# Altium project PhD_Energy_Harvesting_RFG.PrjPcb
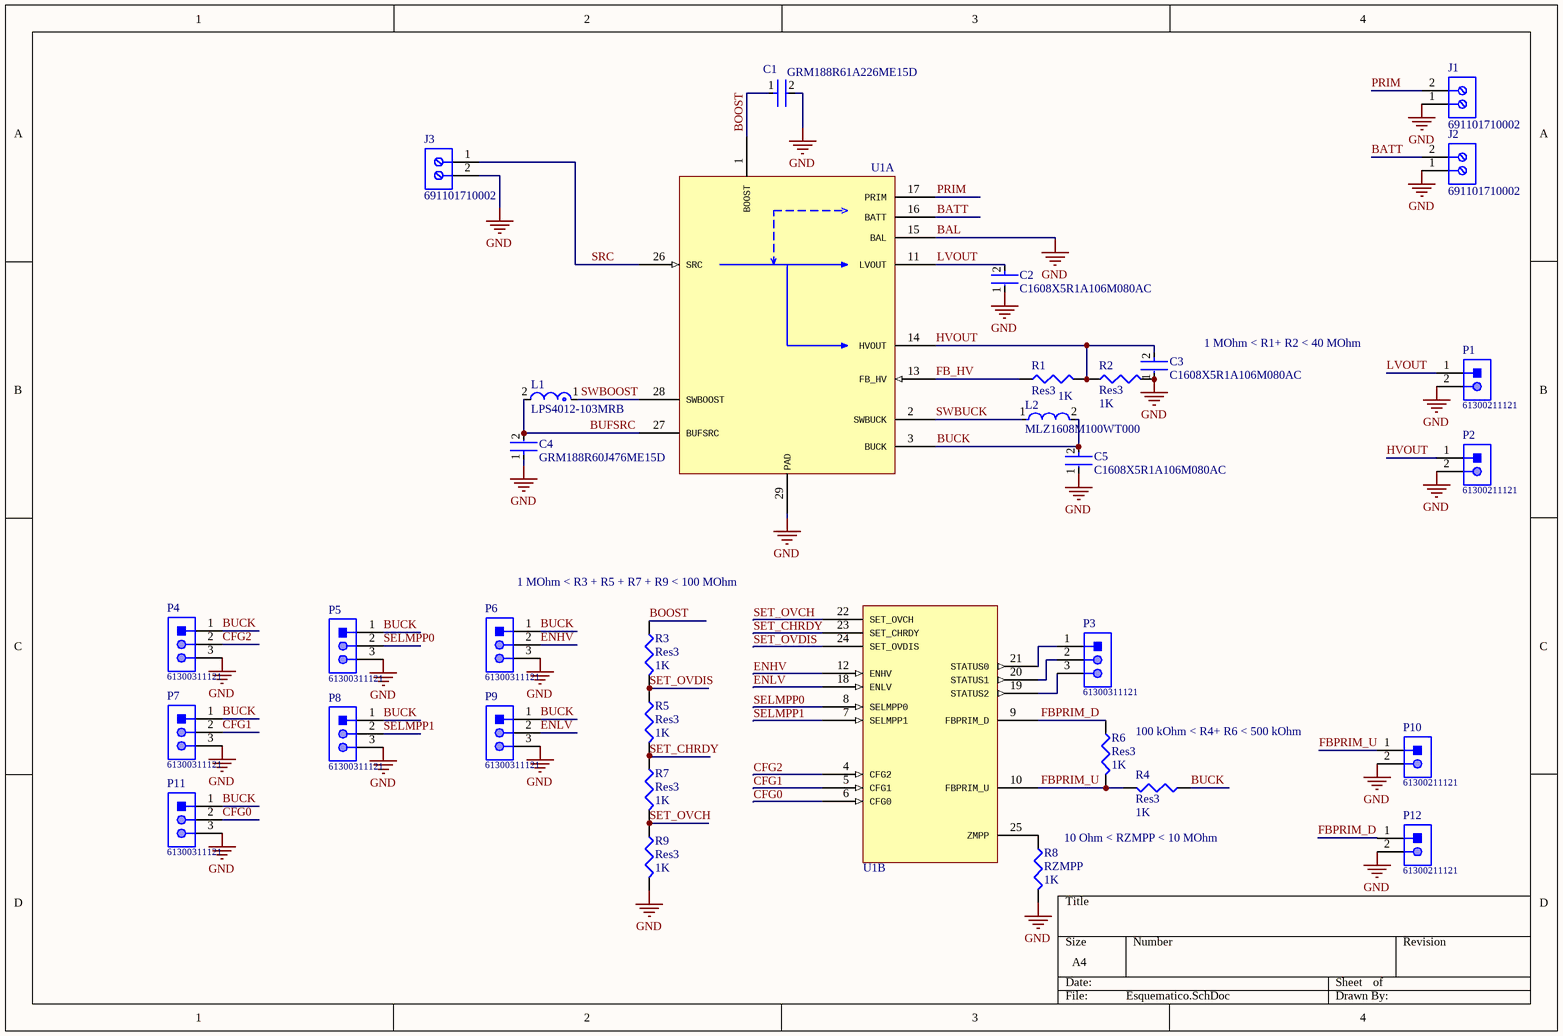
[diagram p0: Esquematico.SchDoc]
1 sheet, 32 parts. Net scope: global (net labels, ports and power ports of the same name join across sheets).
Board file: Board.PcbDoc

## Sheet Esquematico.SchDoc
size A4; SheetNumber: 1; SheetTotal: 1

### Parts
C1  GRM188R61A226ME15D  [FP-GRM188-0_2-IPC_C]
C2  C1608X5R1A106M080AC  [FP-C1608-080-0_1-IPC_A]
C3  C1608X5R1A106M080AC  [FP-C1608-080-0_1-IPC_A]
C4  GRM188R60J476ME15D  [FP-GRM188-0_2-IPC_B]
C5  C1608X5R1A106M080AC  [FP-C1608-080-0_1-IPC_A]
J1  691101710002  [691101710002]
J2  691101710002  [691101710002]
J3  691101710002  [691101710002]
L1  LPS4012-103MRB  [FP-LPS4012-MFG]
L2  MLZ1608M100WT000  [FP-MLZ1608-IPC_C]
P1  61300211121  [61300211121]
P2  61300211121  [61300211121]
P3  61300311121  [61300311121]
P4  61300311121  [61300311121]
P5  61300311121  [61300311121]
P6  61300311121  [61300311121]
P7  61300311121  [61300311121]
P8  61300311121  [61300311121]
P9  61300311121  [61300311121]
P10  61300211121  [61300211121]
P11  61300311121  [61300311121]
P12  61300211121  [61300211121]
R1  Res3  value 1K  [J1-0603]
R2  Res3  value 1K  [J1-0603]
R3  Res3  value 1K  [J1-0603]
R4  Res3  value 1K  [J1-0603]
R5  Res3  value 1K  [J1-0603]
R6  Res3  value 1K  [J1-0603]
R7  Res3  value 1K  [J1-0603]
R8  RZMPP  value 1K  [J1-0603]
R9  Res3  value 1K  [J1-0603]
U1  AEM30940 - SocketQFN28  [QFN28 5x5mm Pitch=0.5mm ThPad=3.15x3.15mm]  (value not drawn)  (parts A,B of 2)

### Nets
BAL: C1.2 C2.1 C3.1 C4.1 C5.1 J1.1 J2.1 J3.2 P1.2 P2.2 P4.3 P5.3 P6.3 P7.3 P8.3 P9.3 P10.2 P11.3 P12.2 R2.2 R8.2 R9.2 U1.15(BAL) U1.29(PAD)  [also labelled GND]
BATT: J2.2 U1.16(BATT)
BOOST: C1.1 R3.1 U1.1(BOOST)
BUCK: C5.2 L2.2 P4.1 P5.1 P6.1 P7.1 P8.1 P9.1 P11.1 R4.1 U1.3(BUCK)
BUFSRC: C4.2 L1.2 U1.27(BUFSRC)
CFG0: P11.2 U1.6(CFG0)
CFG1: P7.2 U1.5(CFG1)
CFG2: P4.2 U1.4(CFG2)
ENHV: P6.2 U1.12(ENHV)
ENLV: P9.2 U1.18(ENLV)
FB_HV: R1.1 U1.13(FB_HV)
FBPRIM_D: P12.1 R6.1 U1.9(FBPRIM_D)
FBPRIM_U: P10.1 R4.2 R6.2 U1.10(FBPRIM_U)
HVOUT: C3.2 P2.1 R1.2 R2.1 U1.14(HVOUT)
LVOUT: C2.2 P1.1 U1.11(LVOUT)
PRIM: J1.2 U1.17(PRIM)
SELMPP0: P5.2 U1.8(SELMPP0)
SELMPP1: P8.2 U1.7(SELMPP1)
SET_CHRDY: R5.2 R7.1 U1.23(SET_CHRDY)
SET_OVCH: R7.2 R9.1 U1.22(SET_OVCH)
SET_OVDIS: R3.2 R5.1 U1.24(SET_OVDIS)
SRC: J3.1 U1.26(SRC)
SWBOOST: L1.1 U1.28(SWBOOST)
SWBUCK: L2.1 U1.2(SWBUCK)
NetP3_1: P3.1 U1.21(STATUS0)
NetP3_2: P3.2 U1.20(STATUS1)
NetP3_3: P3.3 U1.19(STATUS2)
NetR8_1: R8.1 U1.25(ZMPP)

### Notes on the sheet
- 1 MOhm < R1+ R2 < 40 MOhm
- 1 MOhm < R3 + R5 + R7 + R9 < 100 MOhm
- (near R6) 100 kOhm < R4+ R6 < 500 kOhm
- (near R8) 10 Ohm < RZMPP < 10 MOhm

### Library data of the parts
C1 = CMP-2000-06337-3: Chip Multilayer Ceramic Capacitors for General Purpose, 0603, 22uF, X5R, 15%, 20%, 10V; Tolerance: 20%; Weight: 0.000222oz; Material: Ceramic; Depth: 0.8mm; Length: 1.6mm; Termination: SMD/SMT; Capacitance: 22uF; Packaging: Tape and Reel; Width: 0.8mm; Voltage Rating: 10V; Case Code (Imperial): 0603; Mount: Surface Mount; Voltage Rating (DC): 10V; Case/Package: 0603; Thickness: 0.039inch; REACH SVHC: No SVHC; Dielectric: X5R; Height: 0.8mm; Package Quantity: 4000; Case Code (Metric): 1608; Min Operating Temperature: -55°C; Lead Free: Lead Free; Max Operating Temperature: 85°C
C2 C3 C5 = CMP-2000-04980-2: Multilayer Ceramic Capacitors 10μF ±20% 10V X5R SMD 0603; Capacitance: 10uF; Min Operating Temperature: -55°C; RoHS Compliant: Yes; Package Quantity: 1; Max Operating Temperature: 85°C; Radiation Hardening: No; Packaging: Tape and Reel; REACH SVHC: No SVHC; Length: 1.6mm; Case/Package: 0603; Series: C; Voltage Rating: 10V; Thickness: 0.035inch; Weight: 7.1E-05oz; Dielectric: X5R; Termination: SMD/SMT; Dielectric Material: Ceramic; Mount: Surface Mount; Construction: Flat; Resistor Type: Ceramic; Tolerance: 20%; Case Code (Metric): 1608; Number of Pins: 2; Case Code (Imperial): 0603; Depth: 0.8mm; Lead Free: Lead Free; Width: 0.031inch; Height: 0.8mm; Voltage Rating (DC): 10V
C4 = CMP-2000-05444-2: Chip Multilayer Ceramic Capacitors for General Purpose, 0603, 47uF, X5R, 15%, 20%, 6.3V; Voltage Rating (DC): 6.3V; Thickness: 0.039inch; Case Code (Imperial): 0603; Packaging: Tape and Reel; Capacitance: 47uF; Width: 0.031inch; Dielectric: X5R; Max Operating Temperature: 85°C; Mount: Surface Mount; Case Code (Metric): 1608; Length: 0.063inch; Voltage Rating: 6.3V; Tolerance: 20%; Case/Package: 0603; Min Operating Temperature: -55°C
J1-J3 = CMP-1502-03256-1: Series 101 - 5.00 mm Horizontal Entry Modular with Pressure Clamp WR-TBL, 2 pin; Manufacturer: Wurth Elektronik; Pin Number: 2; Pitch: 5.00mm; Package Reference: 691101710002; Part Number: 691101710002; Publisher: WurthElektronik; Datasheet URL: http://katalog.we-online.de/em/datasheet/6911017100xx.pdf; Packaging: Box; Operating Temperature: -40to105degC; Manufacturer URL: http://www.we-online.de; Mounting Technology: THT
L1 = CMP-11268-000103-1: Power Inductor (SMD), 10 µH, 550 mA, Shielded, 1 A, LPS4012 Series, 3.9mm x 3.9mm x 1.1mm; Core Material: Ferrite; Tolerance: 20%; Self Resonant Frequency: 40MHz; Max DC Current: 1.1A; Inductance: 10uH; Test Frequency: 100kHz; Saturation Current: 1A; RMS Current (Irms): 550mA; DC Resistance (DCR): 350mR; Inductance Tolerance: 20%; Package Quantity: 1; Min Operating Temperature: -40°C; Shielding: Shielded; Packaging: Cut Tape; Width: 4mm; Termination: SMD/SMT; RoHS Compliant: Yes; Height: 1.1mm; Weight: 0.002258oz; REACH SVHC: No SVHC; Length: 4mm; Max Operating Temperature: 85°C
L2 = CMP-08253-000012-2: Shielded Multilayer Inductor 10uH ±20% 250mA 1365mΩ SMD 0603; Core Material: Ferrite; Resistance: 1.05R; Test Frequency: 2MHz; DC Resistance (DCR): 1.365R; Self Resonant Frequency: 50MHz; Saturation Current: 90mA; Tolerance: 20%; Current Rating: 250mA; Mount: Surface Mount; Inductance: 10uH; Package Quantity: 4000; Max Operating Temperature: 125°C; RoHS Compliant: Yes; Length: 0.063inch; Case Code (Metric): 1608; Packaging: Tape and Reel; Case/Package: 0603; Min Operating Temperature: -55°C; Case Code (Imperial): 0603; Height - Seated (Max): 0.037inch; Shielding: Shielded; Width: 0.031inch
P1 P2 P10 P12 = CMP-1712-00002-4: THT Vertical Pin Header WR-PHD, Pitch 2.54 mm, Single Row, 2 pins; Manufacturer: Wurth Elektronik; Rated Current: 3A; Gender: Male; Withstanding Voltage: 500VAC; Working Voltage: 250VAC; Pitch: 2.54mm; Contact Resistance: 20mOhm; Pin Number: 2; Mounting Technology: THT; Orientation: Vertical; Operating Temperature: -40to105degC; Packaging: Bag; Publisher: WurthElektronik; Datasheet URL: https://katalog.we-online.de/em/datasheet/6130xx11121.pdf; Manufacturer URL: http://www.we-online.de; Row Number: Single; Package Reference: 61300211121; Part Number: 61300211121
P3-P9 P11 = CMP-1502-01062-1: THT Vertical Pin Header WR-PHD, Pitch 2.54 mm, Single Row, 3 pins; Manufacturer: Wurth Elektronik; Withstanding Voltage: 500VAC; Working Voltage: 250VAC; Rated Current: 3A; Pitch: 2.54mm; Pin Number: 3; Gender: Male; Contact Resistance: 20mOhm; Package Reference: 61300311121; Manufacturer URL: http://www.we-online.de; Datasheet URL: https://katalog.we-online.de/em/datasheet/6130xx11121.pdf; Operating Temperature: -40to105degC; Part Number: 61300311121; Orientation: Vertical; Packaging: Bag; Row Number: Single; Mounting Technology: THT; Publisher: WurthElektronik
R1-R9 = Res3: Resistor; Published: 8-Jun-2000; LatestRevisionDate: 29-May-2009; LatestRevisionNote: IPC-7351 Footprint Added.; PackageReference: J1-0603; Publisher: Altium Limited; PackageDescription: Chip Resistor